# Altium project PCB_121224_01AA.PrjPcb
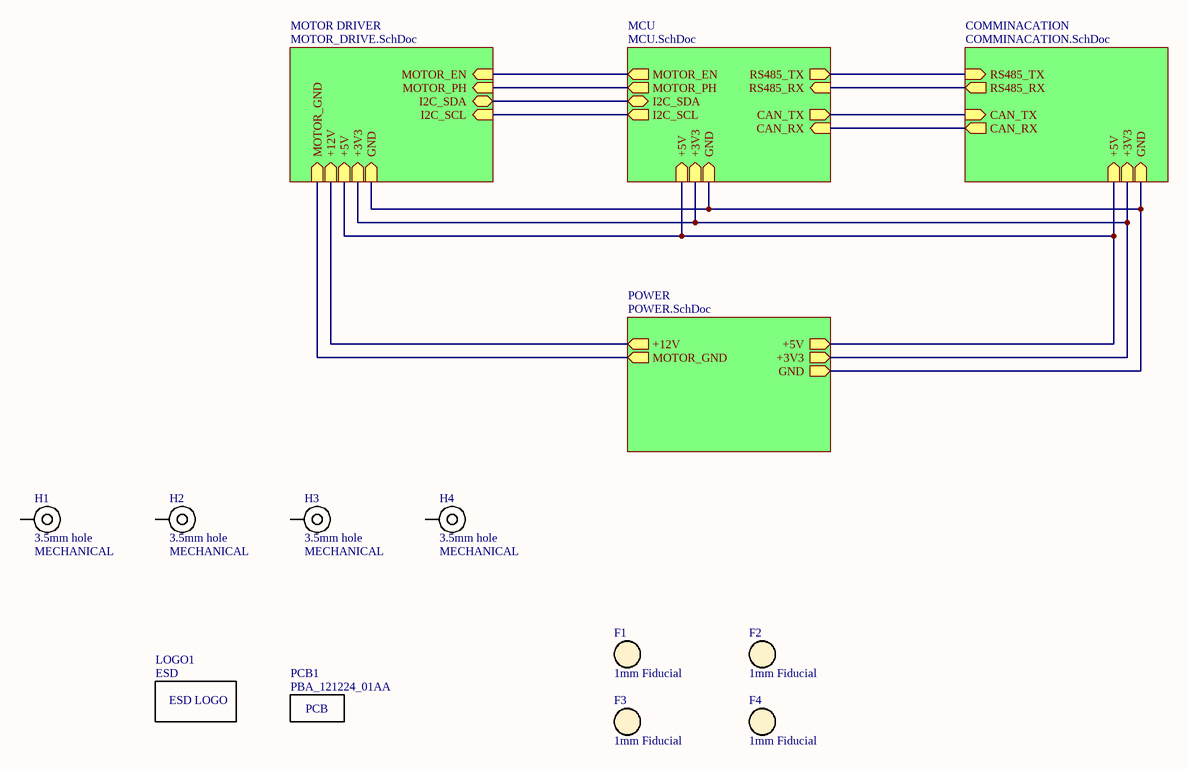
[diagram p0: MAIN.SchDoc]
DocumentName: FIZIKSEL OZELLIKLER DOKUMANI; FO_ApprovedBy: -; FO_CheckedBy: -; pApprovedBy: -; pCheckedBy: Cemil KENDİR; pDesignedBy: Cemil KENDİR; pDesignEnvironment: Altium Designer 23.9.2; pDocumentNumber: PBA_121224_01AA; pDrawnBy: Cemil KENDİR; pFoDate: 13.12.2024; pFoRevision: 01; pModifiedBy: -; pModifiedDate: -; pPBACode: 01; pPBADescription: MOTOR SURUCU KARTI; pPBARevision: AA; pPreparedBy: Cemil KENDİR; pProjectCode: 121224; pProjectName: MOTOR SURUCU KARTI; pReleaseDate: 13.12.24
5 sheets, 125 parts. Net scope: hierarchical (ports join the sheet entries above them; power ports are global).
Board file: PCB_121224_01AA.PcbDoc
Sheets:
  MAIN.SchDoc
    MCU = MCU.SchDoc
    COMMINACATION = COMMINACATION.SchDoc
    POWER = POWER.SchDoc
    MOTOR DRIVER = MOTOR_DRIVE.SchDoc

## Sheet MAIN.SchDoc
size A4; Address1: 00-<Schema Name>; DocumentNumber: 1; SheetNumber: 1; SheetTotal: 5; ModifiedBy: -; Size: A4

### Parts
F1  1mm Fiducial  [1mm Fiducial]  (no BOM)
F2  1mm Fiducial  [1mm Fiducial]  (no BOM)
F3  1mm Fiducial  [1mm Fiducial]  (no BOM)
F4  1mm Fiducial  [1mm Fiducial]  (no BOM)
H1  3.5mm hole  Category: MECHANICAL  [3.5mm hole]  (no BOM)
H2  3.5mm hole  Category: MECHANICAL  [3.5mm hole]  (no BOM)
H3  3.5mm hole  Category: MECHANICAL  [3.5mm hole]  (no BOM)
H4  3.5mm hole  Category: MECHANICAL  [3.5mm hole]  (no BOM)
LOGO1  ESD  [ESD]
PCB1  PBA_121224_01AA  (mechanical)

### Sub-sheets
COMMINACATION = COMMINACATION.SchDoc: +5V (in), GND (in), +3V3 (in), RS485_TX (in), RS485_RX (out), CAN_TX (in), CAN_RX (out)
MCU = MCU.SchDoc: +3V3 (in), GND (in), +5V (in), RS485_TX (out), RS485_RX (in), CAN_TX (out), CAN_RX (in), MOTOR_EN (out), MOTOR_PH (out), I2C_SDA (bidir), I2C_SCL (out)
MOTOR DRIVER = MOTOR_DRIVE.SchDoc: +12V (in), MOTOR_GND (in), +3V3 (in), GND (in), +5V (in), MOTOR_EN (in), MOTOR_PH (in), I2C_SDA (bidir), I2C_SCL (in)
POWER = POWER.SchDoc: +12V (out), +5V (out), +3V3 (out), GND (out), MOTOR_GND (out)

### Nets
+3V3: sheet MCU/+3V3, sheet COMMINACATION/+3V3, sheet POWER/+3V3, sheet MOTOR DRIVER/+3V3
+5V: sheet MCU/+5V, sheet COMMINACATION/+5V, sheet POWER/+5V, sheet MOTOR DRIVER/+5V
+12V: sheet POWER/+12V, sheet MOTOR DRIVER/+12V
GND: sheet MCU/GND, sheet COMMINACATION/GND, sheet POWER/GND, sheet POWER/MOTOR_GND, sheet MOTOR DRIVER/MOTOR_GND, sheet MOTOR DRIVER/GND
CAN_RX: sheet MCU/CAN_RX, sheet COMMINACATION/CAN_RX
CAN_TX: sheet MCU/CAN_TX, sheet COMMINACATION/CAN_TX
I2C_SCL: sheet MCU/I2C_SCL, sheet MOTOR DRIVER/I2C_SCL
I2C_SDA: sheet MCU/I2C_SDA, sheet MOTOR DRIVER/I2C_SDA
MOTOR_EN: sheet MCU/MOTOR_EN, sheet MOTOR DRIVER/MOTOR_EN
MOTOR_PH: sheet MCU/MOTOR_PH, sheet MOTOR DRIVER/MOTOR_PH
RS485_RX: sheet MCU/RS485_RX, sheet COMMINACATION/RS485_RX
RS485_TX: sheet MCU/RS485_TX, sheet COMMINACATION/RS485_TX

Not connected (* = marked no-connect by the designer): H1 1; H2 1; H3 1; H4 1

### Notes on the sheet
- Tarih/Date
- Tasa/Desig
- Kont/Check
- Onay/Appr
- Sayfa/Sht
- Form
- Ortam/Env
- A4
- /
- Deg Tarihi/Chng Date
- Deg Onay/Chng Appr
- Rev
- (c) 2022 by SCSG Elektronik A.Ş.
  All rights Reserved. No part of this document may be produced or transmitted in any form or by any means electronic, mechanical, photocopying, recording, or otherwise, without prior written permission of SCSG.

### Library data of the parts
F1-F4 = 1mm Fiducial: Manufacturer Part Number: Fiducial 2mm; Purpose Of Usage: BASIC; Category: MECHANICAL; Sub-Category: FIDUCIAL; Manufacturer: --; Mount: NO MOUNT; Stock ID: ??; SAP Tanım: -
H1-H4 = 3.5mm hole: 3.5mm delik; Purpose Of Usage: BASIC; Sub-Category: HOLE; Manufacturer: --; Manufacturer Part Number: --; Mount: NO MOUNT; Stock ID: ??
LOGO1 = ESD: ESD LOGO; Category: Logo
PCB1 = PCB: Manufacturer: JLC; Purpose Of Usage: BASIC; Category: MECHANICAL; Local Supplier: CUSTOM; Manufacturer Part Number: PBA_121224_01AA; Mount: MECH; Price 10K: 0.25; SAP Tanım: -; Stock ID: ??; Sub-Category: PCB; Supplier 1: CUSTOM; Supplier Part Number 1: CUSTOM

## Sheet MCU.SchDoc
size A4 portrait; Address1: 00-<Schema Name>; DocumentNumber: 2; SheetNumber: 2; SheetTotal: 5; ModifiedBy: -; Size: A4
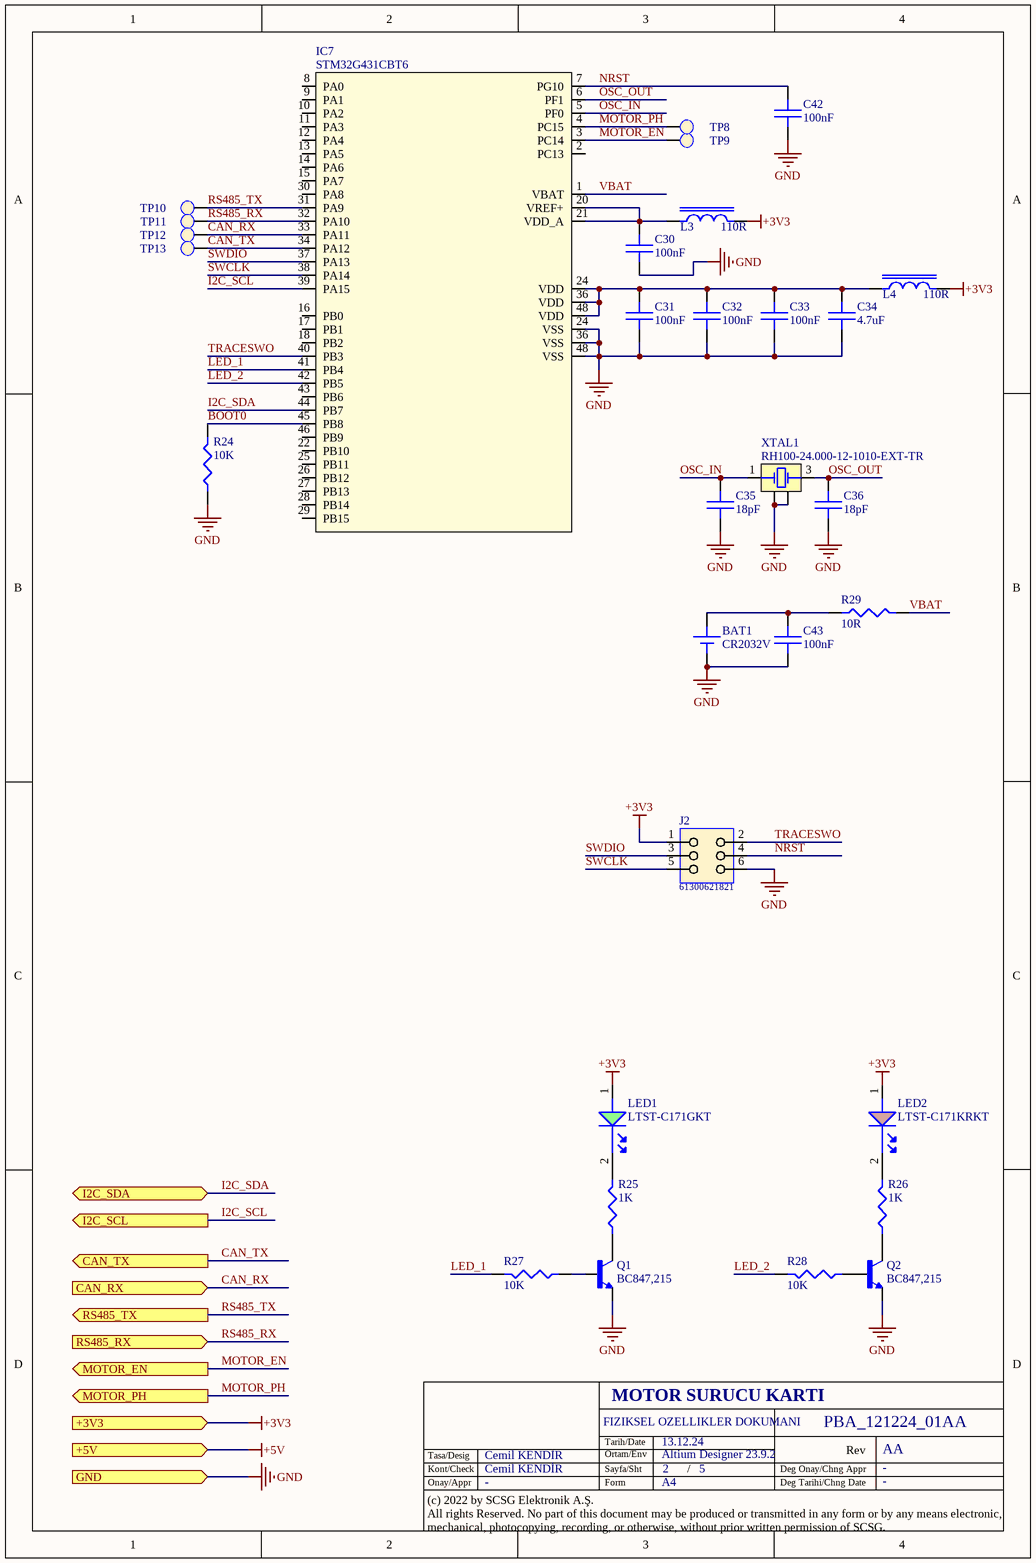
[diagram p1: MCU.SchDoc]

### Parts
BAT1  CR2032V  [CR2032V]
C30  100nF  [C0402]
C31  100nF  [C0402]
C32  100nF  [C0402]
C33  100nF  [C0402]
C34  4.7uF  [C0603]
C35  18pF  [C0402]
C36  18pF  [C0402]
C42  100nF  [C0402]
C43  100nF  [C0402]
IC7  STM32G431CBT6  [LQFP48-7x7mm]
J2  61300621821  [61300621821]
L3  110R  [L0402]
L4  110R  [L0402]
LED1  LTST-C171GKT  [0805_green]
LED2  LTST-C171KRKT  [0805_RED]
Q1  BC847,215  [SOT23-3]
Q2  BC847,215  [SOT23-3]
R24  10K  [R0402]
R25  1K  [R0402]
R26  1K  [R0402]
R27  10K  [R0402]
R28  10K  [R0402]
R29  10R  [R0402]
TP8  TestPoint1  [SMD_1mmPoint]  (value not drawn)  (no BOM)
TP9  TestPoint1  [SMD_1mmPoint]  (value not drawn)  (no BOM)
TP10  TestPoint1  [SMD_1mmPoint]  (value not drawn)  (no BOM)
TP11  TestPoint1  [SMD_1mmPoint]  (value not drawn)  (no BOM)
TP12  TestPoint1  [SMD_1mmPoint]  (value not drawn)  (no BOM)
TP13  TestPoint1  [SMD_1mmPoint]  (value not drawn)  (no BOM)
XTAL1  RH100-24.000-12-1010-EXT-TR  [WE-XTAL_CFPX-180]

### Ports
+3V3 (in), +5V (in), CAN_RX (in), CAN_TX (out), GND (in), I2C_SCL (out), I2C_SDA (bidir), MOTOR_EN (out), MOTOR_PH (out), RS485_RX (in), RS485_TX (out)

### Nets
+3V3: J2.1 L3.2 L4.2 LED1.1 LED2.1 ; port +3V3
GND: BAT1.2 C30.1 C31.1 C32.1 C33.1 C34.1 C35.1 C36.1 C42.1 C43.1 IC7.24(VSS) IC7.36(VSS) IC7.48(VSS) J2.6 Q1.2(E) Q2.2(E) R24.1 XTAL1.2(GND_&_Lid) XTAL1.4(GND_&_Lid) ; port GND
BOOT0: IC7.45(PB8) R24.2
CAN_RX: IC7.33(PA11) TP12.1 ; port CAN_RX
CAN_TX: IC7.34(PA12) TP13.1 ; port CAN_TX
I2C_SCL: IC7.39(PA15) ; port I2C_SCL
I2C_SDA: IC7.44(PB7) ; port I2C_SDA
LED_1: IC7.41(PB4) R27.2
LED_2: IC7.42(PB5) R28.2
MOTOR_EN: IC7.3(PC14) TP9.1 ; port MOTOR_EN
MOTOR_PH: IC7.4(PC15) TP8.1 ; port MOTOR_PH
NRST: C42.2 IC7.7(PG10) J2.4
OSC_IN: C35.2 IC7.5(PF0) XTAL1.1(Crystal)
OSC_OUT: C36.2 IC7.6(PF1) XTAL1.3(Crystal)
RS485_RX: IC7.32(PA10) TP11.1 ; port RS485_RX
RS485_TX: IC7.31(PA9) TP10.1 ; port RS485_TX
SWCLK: IC7.38(PA14) J2.5
SWDIO: IC7.37(PA13) J2.3
TRACESWO: IC7.40(PB3) J2.2
VBAT: IC7.1(VBAT) R29.2
NetBAT1_1: BAT1.1 C43.2 R29.1
NetC30_2: C30.2 IC7.20(VREF+) IC7.21(VDD_A) L3.1
NetC31_2: C31.2 C32.2 C33.2 C34.2 IC7.24(VDD) IC7.36(VDD) IC7.48(VDD) L4.1
NetLED1_2: LED1.2 R25.2
NetLED2_2: LED2.2 R26.2
NetQ1_1: Q1.1(B) R27.1
NetQ1_3: Q1.3(C) R25.1
NetQ2_1: Q2.1(B) R28.1
NetQ2_3: Q2.3(C) R26.1

Not connected (* = marked no-connect by the designer): IC7 2(PC13) 8(PA0) 9(PA1) 10(PA2) 11(PA3) 12(PA4) 13(PA5) 14(PA6) 15(PA7) 16(PB0) 17(PB1) 18(PB2) 22(PB10) 25(PB11) 26(PB12) 27(PB13) 28(PB14) 29(PB15) 30(PA8) 43(PB6) 46(PB9)

### Notes on the sheet
- Tarih/Date
- Tasa/Desig
- Kont/Check
- Onay/Appr
- Sayfa/Sht
- Form
- Ortam/Env
- A4
- /
- Deg Tarihi/Chng Date
- Deg Onay/Chng Appr
- Rev
- (c) 2022 by SCSG Elektronik A.Ş.
  All rights Reserved. No part of this document may be produced or transmitted in any form or by any means electronic, mechanical, photocopying, recording, or otherwise, without prior written permission of SCSG.

### Library data of the parts
BAT1 = CR2032-PEN3-A10606: CR2032 Dikey Montaj; Manufacturer: EEMB; Purpose Of Usage: RTC; Category: BATTERY; Manufacturer Part Number: CR2032-PEN3-A10606; Supplier 1: Ozdisan; Mount: THT; Sub-Category: COIN CELL; Supplier Part Number 1: CR2032-PEN3-A10606; Stock ID: ??
C30-C33 C42 = CC0402KRX7R6BB104: 100nF ,10V ,X7R ,0402; Manufacturer: Yageo; Value: 100000; Tolerance: 10%; Dielectric Material: Ceramic; Purpose Of Usage: BASIC; Supplier 1: Digi-Key; Manufacturer Part Number: CC0402KRX7R6BB104; RoHS: YES; Category: CAPASITOR; Mount: SMD; Case/Package: 0402; Case Code (Imperial): 0402; Case Code (Metric): 1005; Min Operating Temperature: -55°C; Max Operating Temperature: 125°C; Voltage Rating: 10V; Voltage Rating (DC): 10V; Dielectric: X7R; Height: 0.5mm; Supplier Part Number 1: 311-1345-1-ND; Sub-Category: CERAMIC; Stock ID: ??; Local Supplier: GENERAL; Price 10K: 0.00250
C34 = CC0603MRX7R5BB475: 4.7uF, 6.3V, X7R, 0603; Manufacturer: Yageo; Value: 4700000; Tolerance: 20%; Dielectric Material: Ceramic; Purpose Of Usage: BASIC; Supplier 1: Digi-Key; Supplier Part Number 1: 311-3496-6-ND; Manufacturer Part Number: CC0603MRX7R5BB475; RoHS: YES; Mount: SMD; Case/Package: 0603; Case Code (Imperial): 0603; Case Code (Metric): 1608; Min Operating Temperature: -55°C; Max Operating Temperature: 125°C; Voltage Rating: 6.3V; Category: CAPASITOR; Sub-Category: CERAMIC; Dielectric: X7R; Stock ID: ??; Voltage Rating (DC): 6.3V; Local Supplier: GENERAL; Price 10K: 0.00250
C35 C36 = CC0402JRNPO9BN180: 18pF, 50V, C0G, 0402; Manufacturer: Yageo; Value: 18; Tolerance: 5%; Temperature Coefficient: 30ppm/°C; Dielectric Material: Ceramic; Purpose Of Usage: BASIC; Supplier 1: Digi-Key; Manufacturer Part Number: CC0402JRNPO9BN180; RoHS: YES; Category: CAPASITOR; Mount: SMD; Case/Package: 0402; Case Code (Metric): 1005; Case Code (Imperial): 0402; Min Operating Temperature: -55°C; Max Operating Temperature: 125°C; Voltage Rating: 50V; Voltage Rating (DC): 50V; Dielectric: C0G; Height: 0.5mm; Supplier Part Number 1: 311-1415-1-ND; Sub-Category: CERAMIC; Stock ID: ??; Local Supplier: GENERAL; Price 10K: 0.00250
C43 = CC0402KRX7R6BB104: 100nF ,10V ,X7R ,0402; Manufacturer: Yageo; Value: 100000; Tolerance: 10%; Dielectric Material: Ceramic; Purpose Of Usage: RTC; Supplier 1: Digi-Key; Manufacturer Part Number: CC0402KRX7R6BB104; RoHS: YES; Category: CAPASITOR; Mount: SMD; Case/Package: 0402; Case Code (Imperial): 0402; Case Code (Metric): 1005; Min Operating Temperature: -55°C; Max Operating Temperature: 125°C; Voltage Rating: 10V; Voltage Rating (DC): 10V; Dielectric: X7R; Height: 0.5mm; Supplier Part Number 1: 311-1345-1-ND; Sub-Category: CERAMIC; Stock ID: ??; Local Supplier: GENERAL; Price 10K: 0.00250
IC7 = STM32G431CBT6: MCU 32-bit ARM Cortex M4 RISC 128KB Flash 1.8V/2.5V/3.3V 48-Pin LQFP Tray; Manufacturer: STMicroelectronics; Max Supply Voltage: 3.6V; Min Supply Voltage: 1.62V; Purpose Of Usage: BASIC; Manufacturer Part Number: STM32G431CBT6; RoHS: Yes; Category: INTEGRATED CIRCUITS; Case/Package: LQFP; Lead Free: Lead Free; Max Operating Temperature: 85°C; Min Operating Temperature: -40°C; Mount: SMD; Stock ID: ??; Sub-Category: MCU; Supplier 1: Digi-Key; Supplier Part Number 1: 497-19473-ND
J2 = 61300621821: Socket Header, THT, pitch 2.54mm, Dual Row, Vertical, 6pin; Manufacturer: Wurth Electronics; Gender: Female; Purpose Of Usage: BASIC; Manufacturer Part Number: 61300621821; Pitch: 2.54mm; Orientation: Vertical; Category: CONNECTORS; Sub-Category: SOCKET HEADER; Supplier 1: Digi-Key; Supplier Part Number 1: 732-61300621821-ND; Stock ID: ??
L3 L4 = 74269242111: Ferrite Bead, 0.09 Ohm, 1.2A, 0402;; Manufacturer: Wurth Electronics; Purpose Of Usage: BASIC; Supplier 1: Digi-Key; Manufacturer Part Number: 74269242111; RoHS: NO; Category: INDUCTORS; Stock 1: 18401; Supplier Part Number 1: 732-74269242111CT-ND; Case/Package: 0402; Mount: SMD; Stock ID: ??; Sub-Category: FERRITE BEADS
LED1 = LTST-C171GKT: LED GREEN CLEAR CHIP SMD; Manufacturer: Vishay Lite-On; Supplier 1: Digi-Key; Supplier Part Number 1: 160-1423-1-ND; Manufacturer Part Number: LTST-C171GKT; RoHS: YES; Mount: SMD; Case/Package: 0805; Color: Green; Min Operating Temperature: -55°C; Max Operating Temperature: 85°C; Category: DIODE; Sub-Category: LED; Stock ID: ??; Purpose Of Usage: LED
LED2 = LTST-C171KRKT: LED RED CLEAR SMD; Manufacturer: Vishay Lite-On; Supplier 1: Digi-Key; Supplier Part Number 1: 160-1427-1-ND; Manufacturer Part Number: LTST-C171KRKT; RoHS: YES; Mount: SMD; Case/Package: 0805; Color: Red; Min Operating Temperature: -55°C; Max Operating Temperature: 85°C; Category: DIODE; Sub-Category: LED; Stock ID: ??; Purpose Of Usage: LED
Q1 Q2 = BC847,215: TRANS NPN 45V 0.1A SOT23; Manufacturer: Nexperia; Purpose Of Usage: LED; Supplier 1: Digi-Key; Supplier Part Number 1: 1727-4855-1-ND; Manufacturer Part Number: BC847,215; RoHS: No; Category: BJT; Case/Package: SOT-23-3; Max Operating Temperature: 150°C; Min Operating Temperature: -55°C; Mount: SMD; Sub-Category: NPN; Stock ID: ??; Price 10K: 0.021; Local Supplier: OZDISAN
R24 = RC0402FR-0710KL: 10K, %1, 1/16W, 0402; Manufacturer: YAGEO; Voltage Rating: 50V; Value: 10000; Power Rating: 63mW; Tolerance: 1%; Temperature Coefficient: 100ppm/°C; Purpose Of Usage: BASIC; Supplier 1: Digi-Key; Manufacturer Part Number: RC0402FR-0710KL; RoHS: YES; Category: RESISTOR; Case/Package: 0402; Case Code (Imperial): 0402; Min Operating Temperature: -55°C; Max Operating Temperature: 155°C; Max Power Dissipation: 63mW; Voltage Rating (DC): 50V; Working Voltage: 50V; Supplier Part Number 1: 311-10.0KLRCT-ND; Stock ID: ??; Mount: SMD; Sub-Category: CHIP RESISTOR; Price 10K: 0.0025; Local Supplier: GENERAL
R25 R26 = RC0402FR-071KL: 1K, %1, 1/16W, 0402; Manufacturer: YAGEO; Tolerance: 1%; Value: 1000; Temperature Coefficient: 100ppm/°C; Power Rating: 63mW; Voltage Rating: 50V; Purpose Of Usage: LED; Supplier 1: Digi-Key; Manufacturer Part Number: RC0402FR-071KL; RoHS: YES; Category: RESISTOR; Case/Package: 0402; Case Code (Imperial): 0402; Min Operating Temperature: -55°C; Max Operating Temperature: 155°C; Voltage Rating (DC): 50V; Max Power Dissipation: 63mW; Supplier Part Number 1: 311-1.00KLRCT-ND; Stock ID: ??; Mount: SMD; Sub-Category: CHIP RESISTOR; Price 10K: 0.0025; Local Supplier: GENERAL
R27 R28 = RC0402FR-0710KL: 10K, %1, 1/16W, 0402; Manufacturer: YAGEO; Voltage Rating: 50V; Value: 10000; Power Rating: 63mW; Tolerance: 1%; Temperature Coefficient: 100ppm/°C; Purpose Of Usage: LED; Supplier 1: Digi-Key; Manufacturer Part Number: RC0402FR-0710KL; RoHS: YES; Category: RESISTOR; Case/Package: 0402; Case Code (Imperial): 0402; Min Operating Temperature: -55°C; Max Operating Temperature: 155°C; Max Power Dissipation: 63mW; Voltage Rating (DC): 50V; Working Voltage: 50V; Supplier Part Number 1: 311-10.0KLRCT-ND; Stock ID: ??; Mount: SMD; Sub-Category: CHIP RESISTOR; Price 10K: 0.0025; Local Supplier: GENERAL
R29 = RC0402FR-0710RL: 10R, %1, 1/16W, 0402; Manufacturer: YAGEO; Tolerance: 1%; Power Rating: 62.5mW; Voltage Rating: 50V; Value: 10; Temperature Coefficient: 200ppm/°C; Max Power Dissipation: 63mW; Purpose Of Usage: RTC; Supplier 1: Digi-Key; Manufacturer Part Number: RC0402FR-0710RL; RoHS: YES; Category: RESISTOR; Case/Package: 0402; Case Code (Imperial): 0402; Min Operating Temperature: -55°C; Max Operating Temperature: 155°C; Working Voltage: 50V; Supplier Part Number 1: 311-10.0LRTR-ND; Local Supplier: GENERAL; Mount: SMD; Price 10K: 0.0025; Stock ID: ??; Sub-Category: CHIP RESISTOR; Voltage Rating (DC): 50V
TP8-TP13 = TestPoint1: test ölçüm noktası; Manufacturer: NO BOM DEVICE; Purpose Of Usage: BASIC; Category: CONNECTORS; Sub-Category: TEST POINT; Manufacturer Part Number: NO BOM DEVICE; Stock ID: ??
XTAL1 = RH100-24.000-12-1010-EXT-TR: Crystal, 24Mhz, 12Pf, Smd, 3.2Mm X 2.5Mm Rohs Compliant: Yes |Raltron RH100-24.000-12-1010-EXT-TR; Manufacturer: Raltron Electronics; Value: 24000000; Purpose Of Usage: BASIC; Supplier: Digikey; Supplier Part Number 1: 2151-RH100-24.000-12-1010-EXT-TRCT-ND; Manufacturer Part Number: RH100-24.000-12-1010-EXT-TR; RoHS: No; Category: OSCILATOR; Stock: 6000; Case/Package: 3.2 x 2.4; Max Operating Temperature: +85; Min Operating Temperature: -40; Mount: SMD; Stock ID: ??; Sub-Category: CRYSTAL; Supplier 1: Digi-Key

## Sheet COMMINACATION.SchDoc
size A4 portrait; Address1: 00-<Schema Name>; DocumentNumber: 5; SheetNumber: 5; SheetTotal: 5; ModifiedBy: -; RevisionDate: -; Size: A3
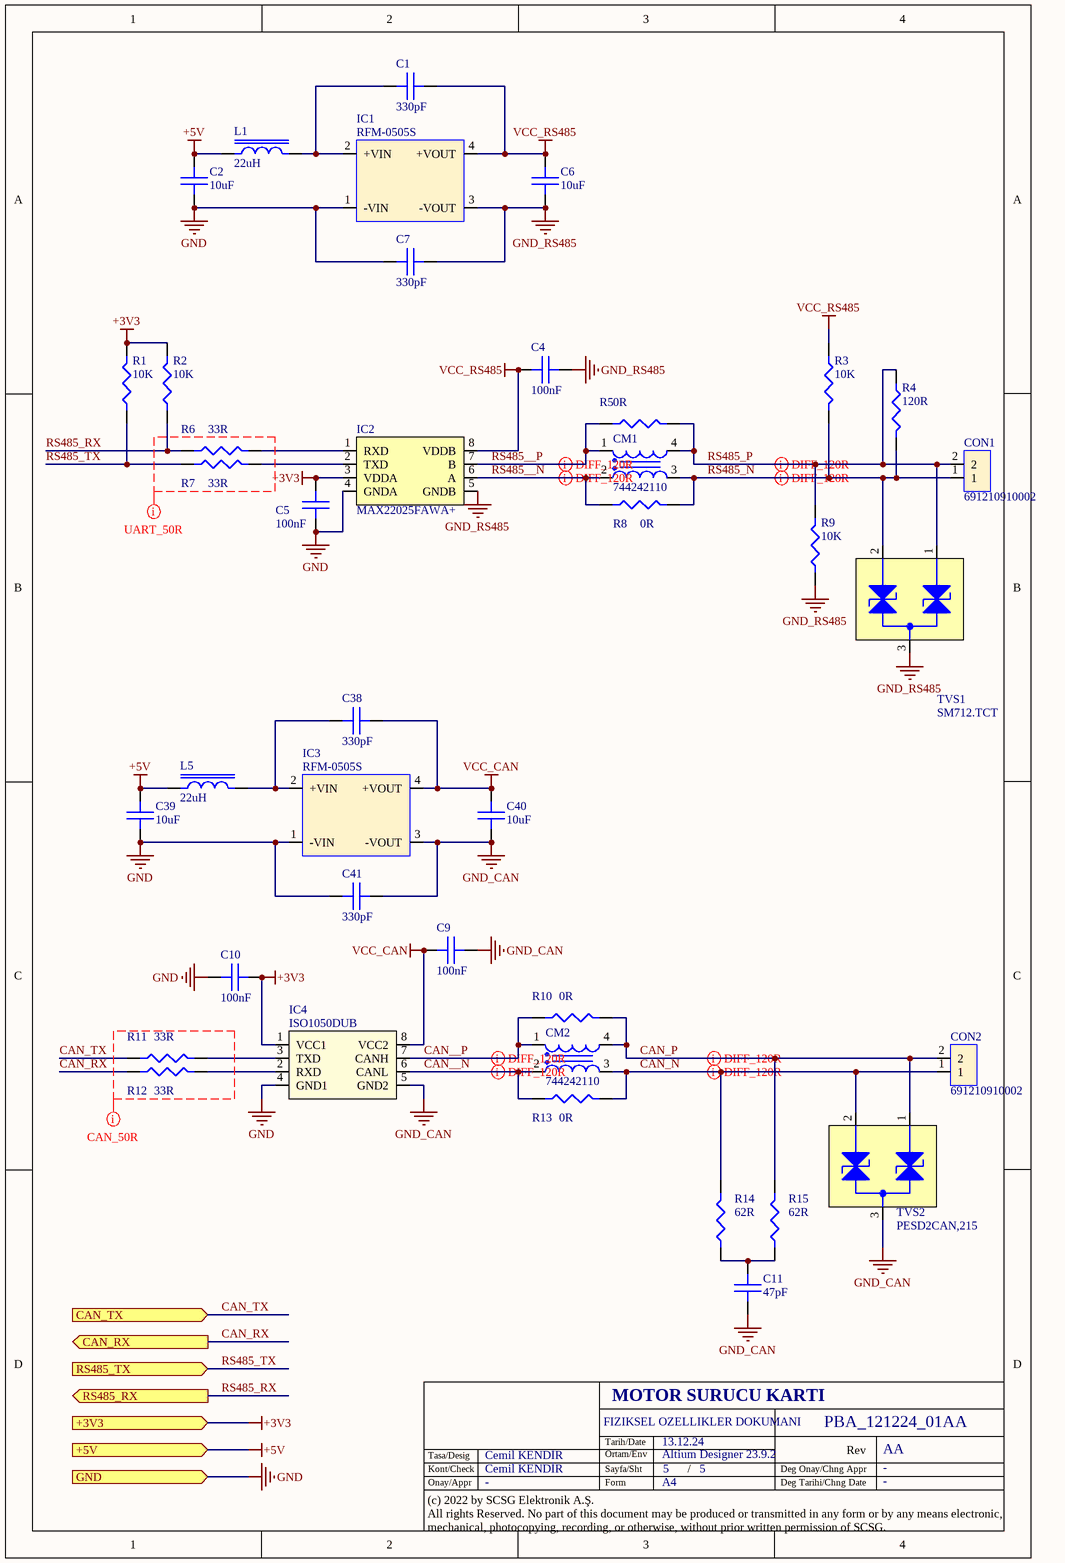
[diagram p2: COMMINACATION.SchDoc]

### Parts
C1  330pF  [C1206]
C2  10uF  [C0402]
C4  100nF  [C0402]
C5  100nF  [C0402]
C6  10uF  [C0402]
C7  330pF  [C1206]
C9  100nF  [C0402]
C10  100nF  [C0402]
C11  47pF  [C0402]
C38  330pF  [C1206]
C39  10uF  [C0402]
C40  10uF  [C0402]
C41  330pF  [C1206]
CM1  744242110  [WE-SLM_L6W3.3H3.3]
CM2  744242110  [WE-SLM_L6W3.3H3.3]
CON1  691210910002  [691210910002]
CON2  691210910002  [691210910002]
IC1  RFM-0505S  [RFM-0505S]
IC2  MAX22025FAWA+  [WIDE SOIC 08]
IC3  RFM-0505S  [RFM-0505S]
IC4  ISO1050DUB  [SOP254P1040X485-8N]
L1  22uH  [WE-LQ_1210]
L5  22uH  [WE-LQ_1210]
R1  10K  [R0402]
R2  10K  [R0402]
R3  10K  [R0402]
R4  120R  [R0603]
R5  0R  [R0402]
R6  33R  [R0402]
R7  33R  [R0402]
R8  0R  [R0402]
R9  10K  [R0402]
R10  0R  [R0402]
R11  33R  [R0402]
R12  33R  [R0402]
R13  0R  [R0402]
R14  62R  [R0805]
R15  62R  [R0805]
TVS1  SM712.TCT  [WE-TVS_SOT23-3L]
TVS2  PESD2CAN,215  [WE-TVS_SOT23-3L]

### Ports
+3V3 (in), +5V (in), CAN_RX (out), CAN_TX (in), GND (in), RS485_RX (out), RS485_TX (in)

### Nets
+3V3: C5.2 C10.2 IC2.3(VDDA) IC4.1(VCC1) R1.2 R2.2 ; port +3V3
+5V: C2.2 C39.2 L1.1 L5.1 ; port +5V
GND: C2.1 C5.1 C7.1 C10.1 C39.1 C41.1 IC1.1(-VIN) IC2.4(GNDA) IC3.1(-VIN) IC4.4(GND1) ; port GND
GND_CAN: C9.1 C11.1 C40.1 C41.2 IC3.3(-VOUT) IC4.5(GND2) TVS2.3(GND)
GND_RS485: C4.1 C6.1 C7.2 IC1.3(-VOUT) IC2.5(GNDB) R9.1 TVS1.3(GND)
VCC_CAN: C9.2 C38.2 C40.2 IC3.4(+VOUT) IC4.8(VCC2)
VCC_RS485: C1.2 C4.2 C6.2 IC1.4(+VOUT) IC2.8(VDDB) R3.1
CAN__N: CM2.2 IC4.6(CANL) R13.1
CAN__P: CM2.1 IC4.7(CANH) R10.1
CAN_N: CM2.3 CON2.1 R13.2 R14.2 TVS2.2(I/O_2)
CAN_P: CM2.4 CON2.2 R10.2 R15.2 TVS2.1(I/O_1)
CAN_RX: R12.1 ; port CAN_RX
CAN_TX: R11.1 ; port CAN_TX
RS485__N: CM1.2 IC2.6(A) R8.1
RS485__P: CM1.1 IC2.7(B) R5.1
RS485_N: CM1.3 CON1.1 R3.2 R4.2 R8.2 TVS1.2(I/O_2)
RS485_P: CM1.4 CON1.2 R4.1 R5.2 R9.2 TVS1.1(I/O_1)
RS485_RX: R2.1 R6.1 ; port RS485_RX
RS485_TX: R1.1 R7.1 ; port RS485_TX
NetC1_1: C1.1 IC1.2(+VIN) L1.2
NetC11_2: C11.2 R14.1 R15.1
NetC38_1: C38.1 IC3.2(+VIN) L5.2
NetIC2_1: IC2.1(RXD) R6.2
NetIC2_2: IC2.2(TXD) R7.2
NetIC4_2: IC4.2(RXD) R12.2
NetIC4_3: IC4.3(TXD) R11.2

### Layout directives
differential pair; differential pair class RS485_120R: RS485__N, RS485__P, RS485_N, RS485_P
differential pair; differential pair class CAN_120R: CAN__N, CAN__P, CAN_N, CAN_P
net class UART_50R: (no net found under the mark)
net class CAN_50R: (no net found under the mark)

### Notes on the sheet
- Tarih/Date
- Tasa/Desig
- Kont/Check
- Onay/Appr
- Sayfa/Sht
- Form
- Ortam/Env
- A4
- /
- Deg Tarihi/Chng Date
- Deg Onay/Chng Appr
- Rev
- (c) 2022 by SCSG Elektronik A.Ş.
  All rights Reserved. No part of this document may be produced or transmitted in any form or by any means electronic, mechanical, photocopying, recording, or otherwise, without prior written permission of SCSG.

### Library data of the parts
C1 C7 = CC1206JKNPOCBN331: 330pF, 1000V,  C0G, 1206; Manufacturer: Yageo; Temperature Coefficient: 30ppm/°C; Dielectric Material: Ceramic; Purpose Of Usage: RS485; Tolerance: 5%; Value: 330000; Manufacturer Part Number: CC1206JKNPOCBN331; RoHS: YES; Category: CAPASITOR; Case/Package: 1206; Case Code (Imperial): 0805; Case Code (Metric): 3216; Dielectric: C0G; Height: 1.15mm; Local Supplier: GENERAL; Max Operating Temperature: 125°C; Min Operating Temperature: -55°C; Mount: SMD; Price 10K: 0.00250; Stock ID: ??; Sub-Category: CERAMIC; Supplier 1: Digi-Key; Supplier Part Number 1: 311-3626-1-ND; Voltage Rating (DC): 1000V; Voltage Rating: 1000V
C2 C6 = GRM155R60J106ME15D: 10uF, 6.3V, X5R, 0402; Manufacturer: Murata; Value: 10000000; Tolerance: 20%; Dielectric Material: Ceramic; Purpose Of Usage: RS485; Supplier 1: Digi-Key; Manufacturer Part Number: GRM155R60J106ME15D; RoHS: YES; Category: CAPASITOR; Mount: SMD; Case/Package: 0402; Case Code (Metric): 1005; Case Code (Imperial): 0402; Min Operating Temperature: -55°C; Max Operating Temperature: 85°C; Voltage Rating: 6.3V; Voltage Rating (DC): 6.3V; Dielectric: X5R; Supplier Part Number 1: 490-13238-1-ND; Sub-Category: CERAMIC; Stock ID: ??; Local Supplier: GENERAL; Price 10K: 0.00250
C4 C5 = CC0402KRX7R6BB104: 100nF ,10V ,X7R ,0402; Manufacturer: Yageo; Value: 100000; Tolerance: 10%; Dielectric Material: Ceramic; Purpose Of Usage: RS485; Supplier 1: Digi-Key; Manufacturer Part Number: CC0402KRX7R6BB104; RoHS: YES; Category: CAPASITOR; Mount: SMD; Case/Package: 0402; Case Code (Imperial): 0402; Case Code (Metric): 1005; Min Operating Temperature: -55°C; Max Operating Temperature: 125°C; Voltage Rating: 10V; Voltage Rating (DC): 10V; Dielectric: X7R; Height: 0.5mm; Supplier Part Number 1: 311-1345-1-ND; Sub-Category: CERAMIC; Stock ID: ??; Local Supplier: GENERAL; Price 10K: 0.00250
C9 C10 = CC0402KRX7R6BB104: 100nF ,10V ,X7R ,0402; Manufacturer: Yageo; Value: 100000; Tolerance: 10%; Dielectric Material: Ceramic; Purpose Of Usage: CAN; Supplier 1: Digi-Key; Manufacturer Part Number: CC0402KRX7R6BB104; RoHS: YES; Category: CAPASITOR; Mount: SMD; Case/Package: 0402; Case Code (Imperial): 0402; Case Code (Metric): 1005; Min Operating Temperature: -55°C; Max Operating Temperature: 125°C; Voltage Rating: 10V; Voltage Rating (DC): 10V; Dielectric: X7R; Height: 0.5mm; Supplier Part Number 1: 311-1345-1-ND; Sub-Category: CERAMIC; Stock ID: ??; Local Supplier: GENERAL; Price 10K: 0.00250
C11 = CC0402JRNPO9BN470: 47pF, 50V, NP0, 0402; Manufacturer: Yageo; Dielectric Material: Ceramic; Value: 47; Tolerance: 5%; Dielectric: C0G; Purpose Of Usage: CAN; Supplier 1: Digi-Key; Manufacturer Part Number: CC0402JRNPO9BN470; RoHS: YES; Category: CAPASITOR; Case/Package: 0402; Case Code (Metric): 1005; Case Code (Imperial): 0402; Min Operating Temperature: -55°C; Max Operating Temperature: 125°C; Voltage Rating: 50V; Voltage Rating (DC): 50V; Height: 0.5mm; Supplier Part Number 1: 311-1021-2-ND; Mount: SMD; Sub-Category: CERAMIC; Local Supplier: GENERAL; Price 10K: 0.00250; Stock ID: ??
C38 C41 = CC1206JKNPOCBN331: 330pF, 1000V,  C0G, 1206; Manufacturer: Yageo; Temperature Coefficient: 30ppm/°C; Dielectric Material: Ceramic; Purpose Of Usage: CAN; Tolerance: 5%; Value: 330000; Manufacturer Part Number: CC1206JKNPOCBN331; RoHS: YES; Category: CAPASITOR; Case/Package: 1206; Case Code (Imperial): 0805; Case Code (Metric): 3216; Dielectric: C0G; Height: 1.15mm; Local Supplier: GENERAL; Max Operating Temperature: 125°C; Min Operating Temperature: -55°C; Mount: SMD; Price 10K: 0.00250; Stock ID: ??; Sub-Category: CERAMIC; Supplier 1: Digi-Key; Supplier Part Number 1: 311-3626-1-ND; Voltage Rating (DC): 1000V; Voltage Rating: 1000V
C39 C40 = GRM155R60J106ME15D: 10uF, 6.3V, X5R, 0402; Manufacturer: Murata; Value: 10000000; Tolerance: 20%; Dielectric Material: Ceramic; Purpose Of Usage: CAN; Supplier 1: Digi-Key; Manufacturer Part Number: GRM155R60J106ME15D; RoHS: YES; Category: CAPASITOR; Mount: SMD; Case/Package: 0402; Case Code (Metric): 1005; Case Code (Imperial): 0402; Min Operating Temperature: -55°C; Max Operating Temperature: 85°C; Voltage Rating: 6.3V; Voltage Rating (DC): 6.3V; Dielectric: X5R; Supplier Part Number 1: 490-13238-1-ND; Sub-Category: CERAMIC; Stock ID: ??; Local Supplier: GENERAL; Price 10K: 0.00250
CM1 = 744242110: Data Line Filter, 2 Function(s), 80V, 0.3A, 4 Pin(s); Manufacturer: Wurth Electronics; Purpose Of Usage: RS485; Manufacturer Part Number: 744242110; RoHS: Yes; Category: PROTECTION; Local Supplier: Wurth Electronics; Mount: SMD; Stock ID: ??; Sub-Category: FILTER-COMMON MODE; Supplier 1: Digikey; Supplier Part Number 1: 732-1681-1-ND
CM2 = 744242110: Data Line Filter, 2 Function(s), 80V, 0.3A, 4 Pin(s); Manufacturer: Wurth Electronics; Purpose Of Usage: CAN; Manufacturer Part Number: 744242110; RoHS: Yes; Category: PROTECTION; Local Supplier: Wurth Electronics; Mount: SMD; Stock ID: ??; Sub-Category: FILTER-COMMON MODE; Supplier 1: Digikey; Supplier Part Number 1: 732-1681-1-ND
CON1 = 691210910002: 2.54 Mm Terminal Block, Horizont; Manufacturer: Wurth Electronics; Purpose Of Usage: RS485; Supplier 1: Digi-Key; Supplier Part Number 1: 732-691210910002-ND; Manufacturer Part Number: 691210910002; RoHS: No; Category: CONNECTORS; Sub-Category: TERMINAL BLOCK; Stock ID: ??
CON2 = 691210910002: 2.54 Mm Terminal Block, Horizont; Manufacturer: Wurth Electronics; Purpose Of Usage: CAN; Supplier 1: Digi-Key; Supplier Part Number 1: 732-691210910002-ND; Manufacturer Part Number: 691210910002; RoHS: No; Category: CONNECTORS; Sub-Category: TERMINAL BLOCK; Stock ID: ??
IC1 = RFM-0505S: RECOM POWER - RFM-0505S - Isolated Board Mount DC/DC Converter, ITE & General, 1 Output, 1 W, 5 V, 200 mA; Purpose Of Usage: RS485; Supplier 1: Digi-Key; Manufacturer: Recom; Manufacturer Part Number: RFM-0505S; RoHS: No; Supplier Part Number 1: 945-3159-ND; Category: MODULE; Mount: SMD; Stock ID: ??; Sub-Category: DC-DC CONVERTERS
IC2 = MAX22025FAWA+: IC Transceiver Half 1/1 8SOIC; Manufacturer: Analog Devices; Purpose Of Usage: RS485; Manufacturer Part Number: MAX22025FAWA+; RoHS: No; Category: INTEGRATED CIRCUITS; Case/Package: WIDE SOIC; Lead Free: Lead Free; Max Operating Temperature: 85°C; Min Operating Temperature: -40°C; Mount: SMD; Stock ID: ??; Sub-Category: RS485 DRIVER; Supplier 1: Digi-Key; Supplier Part Number 1: 505-MAX22025FAWA+-ND
IC3 = RFM-0505S: RECOM POWER - RFM-0505S - Isolated Board Mount DC/DC Converter, ITE & General, 1 Output, 1 W, 5 V, 200 mA; Purpose Of Usage: CAN; Supplier 1: Digi-Key; Manufacturer: Recom; Manufacturer Part Number: RFM-0505S; RoHS: No; Supplier Part Number 1: 945-3159-ND; Category: MODULE; Mount: SMD; Stock ID: ??; Sub-Category: DC-DC CONVERTERS
IC4 = ISO1050DUB: EAR99 ISO1050 Tube CANbus interface transceiver 5V 73mA 850.995985mg 74ns; Manufacturer: Texas Instruments; Max Supply Voltage: 5.5V; Min Supply Voltage: 3V; Purpose Of Usage: CAN; Manufacturer Part Number: ISO1050DUB; RoHS: Yes; Category: INTEGRATED CIRCUITS; Case/Package: SOP; Min Operating Temperature: -55°C; Max Operating Temperature: 105°C; Package Quantity: 50; Lead Free: Lead Free; Mount: SMD; Stock ID: ??; Sub-Category: CAN DRIVER; Supplier 1: Digi-Key; Supplier Part Number 1: 296-33295-5-ND
L1 = 744032220: General Purpose Inductor, 22uH, 10%, 1 Element, Ferrite-Core, SMD, 1210; Manufacturer: Wurth Electronics; Purpose Of Usage: RS485; Manufacturer Part Number: 744032220; RoHS: YES; Category: INDUCTORS; Case/Package: 1210; Local Supplier: Würth; Max Operating Temperature: 125°C; Min Operating Temperature: -40°C; Mount: SMD; Price 10K: 0.18; Stock ID: ??; Sub-Category: FIXED INDUCTORS; Supplier 1: Digi-Key; Supplier Part Number 1: 732-3058-1-ND; Value: 22uH
L5 = 744032220: General Purpose Inductor, 22uH, 10%, 1 Element, Ferrite-Core, SMD, 1210; Manufacturer: Wurth Electronics; Purpose Of Usage: CAN; Manufacturer Part Number: 744032220; RoHS: YES; Category: INDUCTORS; Case/Package: 1210; Local Supplier: Würth; Max Operating Temperature: 125°C; Min Operating Temperature: -40°C; Mount: SMD; Price 10K: 0.18; Stock ID: ??; Sub-Category: FIXED INDUCTORS; Supplier 1: Digi-Key; Supplier Part Number 1: 732-3058-1-ND; Value: 22uH
R1-R3 R9 = RC0402FR-0710KL: 10K, %1, 1/16W, 0402; Manufacturer: YAGEO; Voltage Rating: 50V; Value: 10000; Power Rating: 63mW; Tolerance: 1%; Temperature Coefficient: 100ppm/°C; Purpose Of Usage: RS485; Supplier 1: Digi-Key; Manufacturer Part Number: RC0402FR-0710KL; RoHS: YES; Category: RESISTOR; Case/Package: 0402; Case Code (Imperial): 0402; Min Operating Temperature: -55°C; Max Operating Temperature: 155°C; Max Power Dissipation: 63mW; Voltage Rating (DC): 50V; Working Voltage: 50V; Supplier Part Number 1: 311-10.0KLRCT-ND; Stock ID: ??; Mount: SMD; Sub-Category: CHIP RESISTOR; Price 10K: 0.0025; Local Supplier: GENERAL
R4 = RC0603FR-07120RL: 120R ,%1 ,1/10 W ,0603; Manufacturer: YAGEO; Value: 120; Tolerance: 1%; Voltage Rating (DC): 50V; Temperature Coefficient: 100ppm/°C; Power Rating: 100mW; Purpose Of Usage: RS485; Supplier 1: Digi-Key; Supplier Part Number 1: 311-120HRCT-ND; Manufacturer Part Number: RC0603FR-07120RL; RoHS: YES; Case/Package: 0603; Case Code (Imperial): 0603; Min Operating Temperature: -55°C; Max Operating Temperature: 155°C; Voltage Rating: 50V; Max Power Dissipation: 100mW; Category: RESISTOR; Sub-Category: CHIP RESISTOR; Stock ID: ??; Mount: SMD; Price 10K: 0.0025; Local Supplier: GENERAL
R5 R8 = RC0402FR-070RL: 0R, %1, 1/10W,  0402; Manufacturer: YAGEO; Value: 0; Tolerance: 1%; Power Rating: 63mW; Voltage Rating: 50V; Temperature Coefficient: 200ppm/°C; Purpose Of Usage: RS485; Supplier 1: Digi-Key; Manufacturer Part Number: RC0402FR-070RL; RoHS: YES; Mount: SMD; Case/Package: 0402; Case Code (Imperial): 0402; Min Operating Temperature: -55°C; Max Operating Temperature: 155°C; Max Power Dissipation: 63mW; Category: RESISTOR; Supplier Part Number 1: 311-0.0LRCT-ND; Sub-Category: CHIP RESISTOR; Stock ID: ??; Price 10K: 0.0025; Local Supplier: GENERAL
R6 R7 = RC0402JR-0733RL: 33R, %5, 1/16W ,0402; Manufacturer: YAGEO; Value: 33; Tolerance: 5%; Power Rating: 63mW; Voltage Rating: 50V; Temperature Coefficient: 100ppm/°C; Purpose Of Usage: RS485; Supplier 1: Digi-Key; Manufacturer Part Number: RC0402JR-0733RL; RoHS: YES; Category: RESISTOR; Case/Package: 0402; Case Code (Imperial): 0402; Min Operating Temperature: -55°C; Max Operating Temperature: 155°C; Max Power Dissipation: 63mW; Supplier Part Number 1: 311-33JRCT-ND; Stock ID: ??; Mount: SMD; Sub-Category: CHIP RESISTOR; Price 10K: 0.0025; Local Supplier: GENERAL
R10 R13 = RC0402FR-070RL: 0R, %1, 1/10W,  0402; Manufacturer: YAGEO; Value: 0; Tolerance: 1%; Power Rating: 63mW; Voltage Rating: 50V; Temperature Coefficient: 200ppm/°C; Purpose Of Usage: CAN; Supplier 1: Digi-Key; Manufacturer Part Number: RC0402FR-070RL; RoHS: YES; Mount: SMD; Case/Package: 0402; Case Code (Imperial): 0402; Min Operating Temperature: -55°C; Max Operating Temperature: 155°C; Max Power Dissipation: 63mW; Category: RESISTOR; Supplier Part Number 1: 311-0.0LRCT-ND; Sub-Category: CHIP RESISTOR; Stock ID: ??; Price 10K: 0.0025; Local Supplier: GENERAL
R11 R12 = RC0402JR-0733RL: 33R, %5, 1/16W ,0402; Manufacturer: YAGEO; Value: 33; Tolerance: 5%; Power Rating: 63mW; Voltage Rating: 50V; Temperature Coefficient: 100ppm/°C; Purpose Of Usage: CAN; Supplier 1: Digi-Key; Manufacturer Part Number: RC0402JR-0733RL; RoHS: YES; Category: RESISTOR; Case/Package: 0402; Case Code (Imperial): 0402; Min Operating Temperature: -55°C; Max Operating Temperature: 155°C; Max Power Dissipation: 63mW; Supplier Part Number 1: 311-33JRCT-ND; Stock ID: ??; Mount: SMD; Sub-Category: CHIP RESISTOR; Price 10K: 0.0025; Local Supplier: GENERAL
R14 R15 = RC0805JR-0762RL: 62R, %5, 1/8W, 0805; Manufacturer: YAGEO; Max Power Dissipation: 125mW; Purpose Of Usage: CAN; Temperature Coefficient: 100ppm/°C; Tolerance: 5%; Value: 62; Voltage Rating: 150V; Manufacturer Part Number: RC0805JR-0762RL; RoHS: YES; Category: RESISTOR; Case/Package: 0805; Case Code (Imperial): 0805; Local Supplier: GENERAL; Max Operating Temperature: 155°C; Min Operating Temperature: -55°C; Mount: SMD; Power Rating: 125mW; Price 10K: 0.0025; Stock ID: ??; Sub-Category: CHIP RESISTOR; Supplier 1: Digi-Key; Supplier Part Number 1: 311-62ARCT-ND
TVS1 = SM712.TCT: SM Series 12 V 400 W Asymmetrical TVS Diode for Extended Common-Mode - SOT-23; Manufacturer: Semtech; Direction: Bidirectional; Number of Elements: 2; Min Breakdown Voltage: 7.5V; Clamping Voltage: 26V; Peak Pulse Power: 400W; Leakage Current: 1uA; Peak Pulse Current: 17A; Working Voltage: 12V; Max Breakdown Voltage: 13.3V; ESD Protection: Yes; Max Reverse Leakage Current: 20uA; Number of Channels: 2NUMBER; Purpose Of Usage: RS485; Manufacturer Part Number: SM712.TCT; RoHS: Yes; Category: PROTECTION; Mounting Technology: Surface Mount; Case/Package: SOT-23; Pins: 3; Min Operating Temperature: -55°C; Max Operating Temperature: 125°C; Number of Bidirectional Channels: 2; Power Dissipation: 400W; Polarity: Bidirectional; Max Power Dissipation: 400W; Breakdown Voltage: 13.3V; Voltage Rating (DC): 12V; Clamping Voltage-Max: 12V; Length: 2.9mm; Lead Free: Lead Free; Local Supplier: GENERAL; Mount: SMD; Power Rating: 400W; Price 10K: 0.5; Stock ID: ??; Sub-Category: TVS - BI DIRECTIONAL; Supplier 1: Digikey; Supplier Part Number 1: SM712CT-ND
TVS2 = PESD2CAN,215: PESD Series 2 Channel Bi-Directional CAN Bus ESD Protection Diode - SOT-23; Manufacturer: Nexperia USA; Manufacturer Part Number: PESD2CAN,215; RoHS: No; Category: PROTECTION; Case/Package: SOT-23; Local Supplier: GENERAL; Mount: SMD; Stock ID: ??; Sub-Category: TVS - BI DIRECTIONAL; Supplier Part Number 1: 1727-3891-2-ND; Purpose Of Usage: CAN; Supplier 1: Digikey

## Sheet POWER.SchDoc
size A4; Address1: 00-<Schema Name>; DocumentNumber: 3; SheetNumber: 3; SheetTotal: 5; ModifiedBy: -; Size: A4
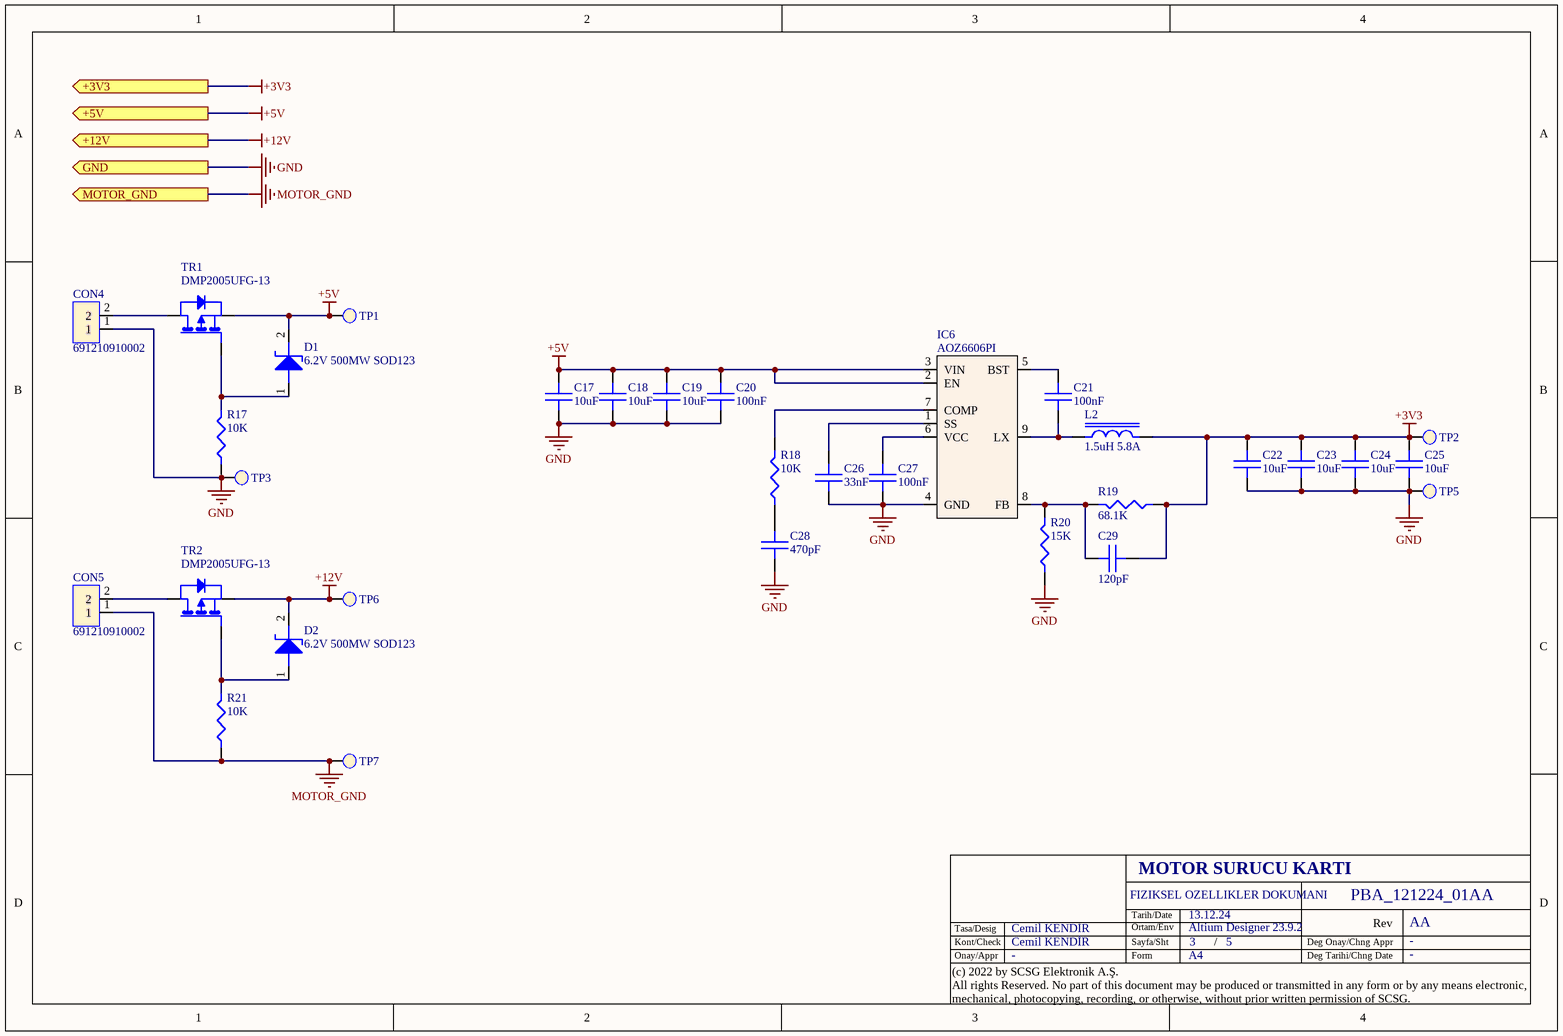
[diagram p3: POWER.SchDoc]

### Parts
C17  10uF  [C0805]
C18  10uF  [C0805]
C19  10uF  [C0805]
C20  100nF  [C0402]
C21  100nF  [C0402]
C22  10uF  [C0805]
C23  10uF  [C0805]
C24  10uF  [C0805]
C25  10uF  [C0805]
C26  33nF  [C0402]
C27  100nF  [C0402]
C28  470pF  [C0402]
C29  120pF  [C0402]
CON4  691210910002  [691210910002]
CON5  691210910002  [691210910002]
D1  6.2V 500MW SOD123  [SOD123]
D2  6.2V 500MW SOD123  [SOD123]
IC6  AOZ6606PI  [SO08 - EP1]
L2  1.5uH 5.8A  [WE-MAPI_4020]
R17  10K  [R0402]
R18  10K  [R0402]
R19  68.1K  [R0402]
R20  15K  [R0402]
R21  10K  [R0402]
TP1  TestPoint1  [SMD_1mmPoint]  (value not drawn)  (no BOM)
TP2  TestPoint1  [SMD_1mmPoint]  (value not drawn)  (no BOM)
TP3  TestPoint1  [SMD_1mmPoint]  (value not drawn)  (no BOM)
TP5  TestPoint1  [SMD_1mmPoint]  (value not drawn)  (no BOM)
TP6  TestPoint1  [SMD_1mmPoint]  (value not drawn)  (no BOM)
TP7  TestPoint1  [SMD_1mmPoint]  (value not drawn)  (no BOM)
TR1  DMP2005UFG-13  [PowerDI3333-8]
TR2  DMP2005UFG-13  [PowerDI3333-8]

### Ports
+3V3 (out), +5V (out), +12V (out), GND (out), MOTOR_GND (out)

### Nets
+3V3: C22.2 C23.2 C24.2 C25.2 C29.2 L2.2 R19.1 TP2.1 ; port +3V3
+5V: C17.2 C18.2 C19.2 C20.2 D1.2(K) IC6.2(EN) IC6.3(VIN) TP1.1 TR1.1(S) ; port +5V
+12V: D2.2(K) TP6.1 TR2.1(S) ; port +12V
GND: C17.1 C18.1 C19.1 C20.1 C22.1 C23.1 C24.1 C25.1 C26.1 C27.1 C28.1 CON4.1 CON5.1 IC6.4(GND) R17.1 R20.1 R21.1 TP3.1 TP5.1 TP7.1 ; port GND, port MOTOR_GND  [also labelled MOTOR_GND]
NetC21_1: C21.1 IC6.5(BST)
NetC21_2: C21.2 IC6.9(LX) L2.1
NetC26_2: C26.2 IC6.1(SS)
NetC27_2: C27.2 IC6.6(VCC)
NetC28_2: C28.2 R18.1
NetC29_1: C29.1 IC6.8(FB) R19.2 R20.2
NetCON4_2: CON4.2 TR1.3(D)
NetCON5_2: CON5.2 TR2.3(D)
NetD1_1: D1.1(A) R17.2 TR1.2(G)
NetD2_1: D2.1(A) R21.2 TR2.2(G)
NetIC6_7: IC6.7(COMP) R18.2

### Notes on the sheet
- Tarih/Date
- Tasa/Desig
- Kont/Check
- Onay/Appr
- Sayfa/Sht
- Form
- Ortam/Env
- A4
- /
- Deg Tarihi/Chng Date
- Deg Onay/Chng Appr
- Rev
- (c) 2022 by SCSG Elektronik A.Ş.
  All rights Reserved. No part of this document may be produced or transmitted in any form or by any means electronic, mechanical, photocopying, recording, or otherwise, without prior written permission of SCSG.

### Library data of the parts
C17-C19 C22-C25 = CC0805KFX7R6BB106: 10uF ,10V ,X7R ,0805; Manufacturer: Yageo; Value: 10000000; Dielectric Material: Ceramic; Tolerance: 10%; Purpose Of Usage: BASIC; Supplier 1: Digi-Key; Manufacturer Part Number: CC0805KFX7R6BB106; RoHS: YES; Supplier Part Number 1: 13-CC0805KFX7R6BB106CT-ND; Category: CAPASITOR; Sub-Category: CERAMIC; Case/Package: 0805; Case Code (Imperial): 0805; Case Code (Metric): 2012; Dielectric: X7R; Max Operating Temperature: 125°C; Min Operating Temperature: -55°C; Mount: SMD; Stock ID: ??; Voltage Rating (DC): 10V; Voltage Rating: 10V; Local Supplier: GENERAL; Price 10K: 0.00250
C20 C21 C27 = CC0402KRX7R6BB104: as C30 on sheet MCU; Supplier 1: Digi-Key; Manufacturer Part Number: CC0402KRX7R6BB104; RoHS: YES; Category: CAPASITOR; Mount: SMD; Case/Package: 0402; Case Code (Imperial): 0402; Case Code (Metric): 1005; Min Operating Temperature: -55°C; Max Operating Temperature: 125°C; Voltage Rating: 10V; Voltage Rating (DC): 10V; Dielectric: X7R; Height: 0.5mm; Supplier Part Number 1: 311-1345-1-ND; Sub-Category: CERAMIC; Stock ID: ??; Local Supplier: GENERAL; Price 10K: 0.00250
C26 = CC0402KRX7R9BB333: 33nF, 50V, X7R, 0402; Manufacturer: Yageo; Value: 33000; Temperature Coefficient: 30ppm/°C; Dielectric Material: Ceramic; Purpose Of Usage: BASIC; Tolerance: 10%; Manufacturer Part Number: CC0402KRX7R9BB333; RoHS: YES; Category: CAPASITOR; Case/Package: 0402; Min Operating Temperature: -55°C; Max Operating Temperature: 125°C; Dielectric: X7R; Voltage Rating: 50V; Voltage Rating (DC): 50V; Height: 0.5mm; Case Code (Imperial): 0402; Case Code (Metric): 1005; Local Supplier: GENERAL; Mount: SMD; Price 10K: 0.00250; Stock ID: ??; Sub-Category: CERAMIC; Supplier 1: Digi-Key; Supplier Part Number 1: 13-CC0402KRX7R9BB333CT-ND
C28 = CC0402JRNPO9BN471: 470pF, 50V, NP0, 0402; Manufacturer: Yageo; Tolerance: 5%; Value: 470; Dielectric: C0G; Dielectric Material: Ceramic; Purpose Of Usage: BASIC; Supplier 1: Digi-Key; Manufacturer Part Number: CC0402JRNPO9BN471; RoHS: YES; Category: CAPASITOR; Case/Package: 0402; Case Code (Imperial): 0402; Case Code (Metric): 1005; Min Operating Temperature: -55°C; Max Operating Temperature: 125°C; Voltage Rating (DC): 50V; Voltage Rating: 50V; Supplier Part Number 1: 311-1671-2-ND; Height: 0.5mm; Local Supplier: GENERAL; Mount: SMD; Price 10K: 0.00250; Stock ID: ??; Sub-Category: CERAMIC
C29 = CC0402JRNPO9BN121: 120pF, 50V, NP0, 0402; Manufacturer: Yageo; Tolerance: 5%; Value: 120; Dielectric: C0G; Dielectric Material: Ceramic; Purpose Of Usage: BASIC; Supplier 1: Digi-Key; Manufacturer Part Number: CC0402JRNPO9BN121; RoHS: YES; Category: CAPASITOR; Mount: SMD; Case/Package: 0402; Case Code (Imperial): 0402; Case Code (Metric): 1005; Min Operating Temperature: -55°C; Max Operating Temperature: 125°C; Voltage Rating: 50V; Voltage Rating (DC): 50V; Height: 0.5mm; Supplier Part Number 1: 311-3337-1-ND; Sub-Category: CERAMIC; Stock ID: ??; Local Supplier: GENERAL; Price 10K: 0.00250
CON4 CON5 = 691210910002: 2.54 Mm Terminal Block, Horizont; Manufacturer: Wurth Electronics; Purpose Of Usage: BASIC; Supplier 1: Digi-Key; Supplier Part Number 1: 732-691210910002-ND; Manufacturer Part Number: 691210910002; RoHS: No; Category: CONNECTORS; Sub-Category: TERMINAL BLOCK; Stock ID: ??
D1 D2 = MMSZ5234B-7-F: DIODE ZENER 6.2V 500MW SOD123; Manufacturer: Diodes; Element Configuration: Single; Purpose Of Usage: BASIC; Supplier 1: Digi-Key; Supplier Part Number 1: MMSZ5234B-FDICT-ND; Manufacturer Part Number: MMSZ5234B-7-F; RoHS: YES; Mount: SMD; Case/Package: SOD-123-2; Min Operating Temperature: -65°C; Max Operating Temperature: 150°C; Category: DIODE; Sub-Category: ZENER; Stock ID: ??
IC6 = AOZ6606PI: Switching Regulator, Current-mode, 6A, 650kHz Switching Freq-Max, PDSO8; Manufacturer: Alpha & Omega Semiconductor; Max Supply Voltage: 15.3V; Min Supply Voltage: 4.5V; Purpose Of Usage: BASIC; Topology: BUCK; Manufacturer Part Number: AOZ6606PI; RoHS: Yes; Category: INTEGRATED CIRCUITS; Case/Package: SO-08 EP; Lead Free: Lead Free; Max Operating Temperature: 85°C; Min Operating Temperature: -40°C; Mount: SMD; Stock ID: ??; Sub-Category: PMIC - DC/DC Switching Regulator; Supplier 1: Digi-Key; Supplier Part Number 1: 785-1854-1-ND
L2 = 74438356015: Fixed Ind 1.5UH 5.8A 19 Mohm SMD; Manufacturer: Wurth Electronics; Saturation Current: 7.8A; Shielding: Shielded; DC Resistance (DCR): 19mR; Self Resonant Frequency: 48MHz; Test Frequency: 100kHz; Tolerance: 20%; Purpose Of Usage: BASIC; Manufacturer Part Number: 74438356015; RoHS: YES; Category: INDUCTORS; Case/Package: Nonstandard; Min Operating Temperature: -40°C; Max Operating Temperature: 125°C; Value: 1.5uH; Current Rating: 5.8A; RMS Current (Irms): 5.8A; Inductance Tolerance: 20%; Series: WE-MAPI; Length: 0.161inch; RoHS Compliant: Yes; Mount: SMD; Stock ID: ??; Sub-Category: FIXED INDUCTORS; Supplier 1: Digi-Key; Supplier Part Number 1: 732-8230-1-ND
R17 R18 R21 = RC0402FR-0710KL: as R24 on sheet MCU; Supplier 1: Digi-Key; Manufacturer Part Number: RC0402FR-0710KL; RoHS: YES; Category: RESISTOR; Case/Package: 0402; Case Code (Imperial): 0402; Min Operating Temperature: -55°C; Max Operating Temperature: 155°C; Max Power Dissipation: 63mW; Voltage Rating (DC): 50V; Working Voltage: 50V; Supplier Part Number 1: 311-10.0KLRCT-ND; Stock ID: ??; Mount: SMD; Sub-Category: CHIP RESISTOR; Price 10K: 0.0025; Local Supplier: GENERAL
R19 = RC0402FR-0768K1L: 68.1K, %1, 1/16W, 0402; Manufacturer: YAGEO; Voltage Rating (DC): 50V; Max Power Dissipation: 63mW; Power Rating: 62.5mW; Purpose Of Usage: BASIC; Temperature Coefficient: 100ppm/°C; Tolerance: 1%; Value: 68100; Manufacturer Part Number: RC0402FR-0768K1L; RoHS: YES; Category: RESISTOR; Case/Package: 0402; Case Code (Imperial): 0402; Local Supplier: GENERAL; Max Operating Temperature: 155°C; Min Operating Temperature: -55°C; Mount: SMD; Price 10K: 0.0025; Stock ID: ??; Sub-Category: CHIP RESISTOR; Supplier 1: Digi-Key; Supplier Part Number 1: YAG3213CT-ND; Voltage Rating: 50V
R20 = RC0402FR-0715KL: 15K, %1, 1/16W, 0402; Manufacturer: YAGEO; Tolerance: 1%; Power Rating: 62.5mW; Value: 15000; Voltage Rating: 50V; Temperature Coefficient: 100ppm/°C; Max Power Dissipation: 63mW; Purpose Of Usage: BASIC; Manufacturer Part Number: RC0402FR-0715KL; RoHS: Yes; Category: RESISTOR; Case/Package: 0402; Case Code (Imperial): 0402; Min Operating Temperature: -55°C; Max Operating Temperature: 155°C; Voltage Rating (DC): 50V; Local Supplier: GENERAL; Mount: SMD; Price 10K: 0.0025; Stock ID: ??; Sub-Category: CHIP RESISTOR; Supplier 1: Digi-Key; Supplier Part Number 1: 311-15.0KLRCT-ND
TP1-TP3 TP5-TP7 = TestPoint1: as TP8 on sheet MCU; Category: CONNECTORS; Sub-Category: TEST POINT; Manufacturer Part Number: NO BOM DEVICE; Stock ID: ??
TR1 TR2 = DMP2005UFG-13: 20V P-channel Enhancement Mode Mosfet, 20V Vds, 10±V Vgs; Manufacturer: Diodes; Max Power Dissipation: 2.2W; Purpose Of Usage: BASIC; Manufacturer Part Number: DMP2005UFG-13; RoHS: Yes; Category: MOSFETs; Min Operating Temperature: -55°C; Max Operating Temperature: 150°C; Case/Package: DI3333-8; Mount: SMD; Polarity: P-CHANNEL; Stock ID: ??; Sub-Category: P-CHANNEL; Supplier 1: Digi-Key; Supplier Part Number 1: 31-DMP2005UFG-13CT-ND

## Sheet MOTOR_DRIVE.SchDoc
size A4; DocumentNumber: 4; SheetNumber: 4; SheetTotal: 5
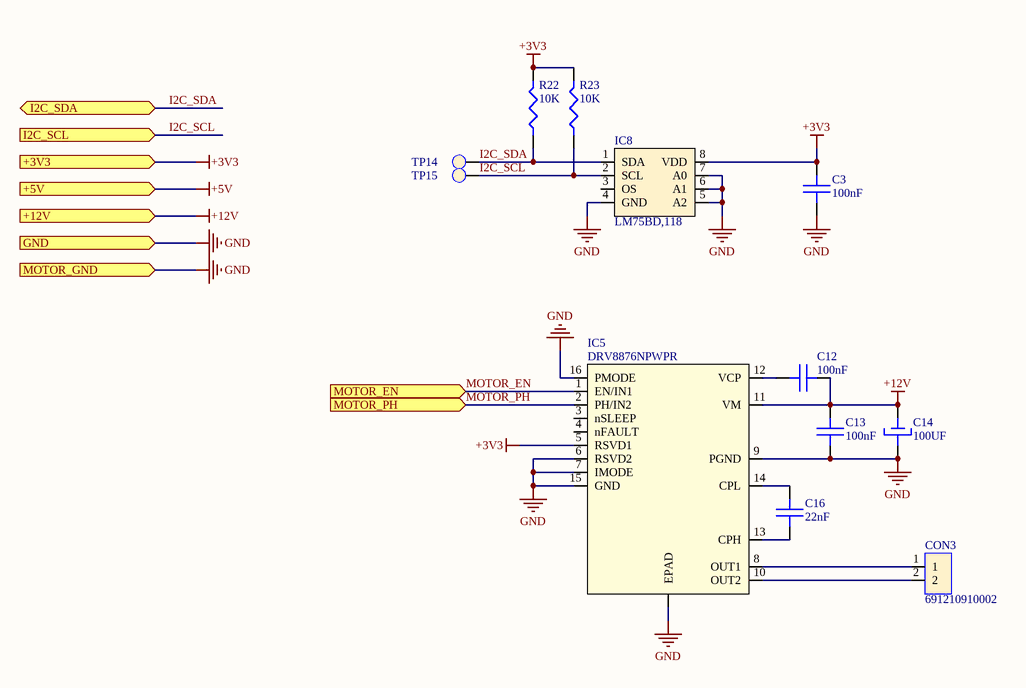
[diagram p4: MOTOR_DRIVE.SchDoc]

### Parts
C3  100nF  [C0402]
C12  100nF  [C0603]
C13  100nF  [C0603]
C14  100UF  [6mm Aliminyum Smd]
C16  22nF  [C0805]
CON3  691210910002  [691210910002]
IC5  DRV8876NPWPR  [HTSSOP16_4P4X5_TEX-M]
IC8  LM75BD,118  [SO08]
R22  10K  [R0402]
R23  10K  [R0402]
TP14  TestPoint1  [SMD_1mmPoint]  (value not drawn)  (no BOM)
TP15  TestPoint1  [SMD_1mmPoint]  (value not drawn)  (no BOM)

### Ports
+3V3 (in), +5V (in), +12V (in), GND (in), I2C_SCL (in), I2C_SDA (bidir), MOTOR_EN (in), MOTOR_GND (in), MOTOR_PH (in)

### Nets
+3V3: C3.2 IC5.5(RSVD1) IC8.8(VDD) R22.2 R23.2 ; port +3V3
+12V: C12.2 C13.2 C14.1 IC5.11(VM) ; port +12V
GND: C3.1 C13.1 C14.2 IC5.6(RSVD2) IC5.7(IMODE) IC5.9(PGND) IC5.15(GND) IC5.16(PMODE) IC5.EPAD IC8.4(GND) IC8.5(A2) IC8.6(A1) IC8.7(A0) ; port GND, port MOTOR_GND
I2C_SCL: IC8.2(SCL) R23.1 TP15.1 ; port I2C_SCL
I2C_SDA: IC8.1(SDA) R22.1 TP14.1 ; port I2C_SDA
MOTOR_EN: IC5.1(EN/IN1) ; port MOTOR_EN
MOTOR_PH: IC5.2(PH/IN2) ; port MOTOR_PH
NetC12_1: C12.1 IC5.12(VCP)
NetC16_1: C16.1 IC5.13(CPH)
NetC16_2: C16.2 IC5.14(CPL)
NetCON3_1: CON3.1 IC5.8(OUT1)
NetCON3_2: CON3.2 IC5.10(OUT2)

Not connected (* = marked no-connect by the designer): IC5 3(nSLEEP) 4(nFAULT); IC8 3(OS)

### Notes on the sheet
- Tarih/Date
- Tasa/Desig
- Kont/Check
- Onay/Appr
- Sayfa/Sht
- Form
- Ortam/Env
- A4
- /
- Deg Tarihi/Chng Date
- Deg Onay/Chng Appr
- Rev
- (c) 2022 by SCSG Elektronik A.Ş.
  All rights Reserved. No part of this document may be produced or transmitted in any form or by any means electronic, mechanical, photocopying, recording, or otherwise, without prior written permission of SCSG.

### Library data of the parts
C3 = CC0402KRX7R6BB104: 100nF ,10V ,X7R ,0402; Manufacturer: Yageo; Value: 100000; Tolerance: 10%; Dielectric Material: Ceramic; Purpose Of Usage: MOTOR; Supplier 1: Digi-Key; Manufacturer Part Number: CC0402KRX7R6BB104; RoHS: YES; Category: CAPASITOR; Mount: SMD; Case/Package: 0402; Case Code (Imperial): 0402; Case Code (Metric): 1005; Min Operating Temperature: -55°C; Max Operating Temperature: 125°C; Voltage Rating: 10V; Voltage Rating (DC): 10V; Dielectric: X7R; Height: 0.5mm; Supplier Part Number 1: 311-1345-1-ND; Sub-Category: CERAMIC; Stock ID: ??; Local Supplier: GENERAL; Price 10K: 0.00250
C12 C13 = CC0603KRX7R8BB104: 100nF, 25V, X7R, 0603; Manufacturer: Yageo; Value: 100000; Tolerance: 10%; Dielectric Material: Ceramic; Purpose Of Usage: MOTOR; Supplier 1: Digi-Key; Supplier Part Number 1: 311-1341-1-ND; Manufacturer Part Number: CC0603KRX7R8BB104; RoHS: YES; Mount: SMD; Case/Package: 0603; Case Code (Imperial): 0603; Case Code (Metric): 1608; Min Operating Temperature: -55°C; Max Operating Temperature: 125°C; Voltage Rating: 25V; Voltage Rating (DC): 25V; Dielectric: X7R; Height: 0.8mm; Category: CAPASITOR; Sub-Category: CERAMIC; Stock ID: ??; Local Supplier: GENERAL; Price 10K: 0.00250
C14 = UWX1C101MCL1GB: 100uF, 16V, ELC, 6.3mm SMD; Manufacturer: Nichicon; Dielectric Material: Aluminium; Value: 100000000; Tolerance: 20%; Dielectric: Polymer; Purpose Of Usage: MOTOR; Supplier 1: Digi-Key; Supplier Part Number 1: 493-2105-1-ND; Manufacturer Part Number: UWX1C101MCL1GB; RoHS: YES; Mount: SMD; Case/Package: Radial; Min Operating Temperature: -40°C; Max Operating Temperature: 85°C; Voltage Rating: 16V; Voltage Rating (DC): 16V; Diameter: 6.3mm; Height: 5.5mm; Category: CAPASITOR; Sub-Category: ALUMINUM; Stock ID: ??; Case Code (Imperial): 6.3 mm; Local Supplier: GENERAL; Price 10K: 0.00250
C16 = CC0805KRX7R9BB223: 22nF, 50 V, X7R, 0805; Manufacturer: Yageo; Dielectric Material: Ceramic; Value: 22000; Tolerance: 10%; Voltage Rating: 50V; Purpose Of Usage: MOTOR; Supplier 1: Digi-Key; Manufacturer Part Number: CC0805KRX7R9BB223; RoHS: YES; Category: CAPASITOR; Case/Package: 0805; Case Code (Metric): 2012; Case Code (Imperial): 0805; Min Operating Temperature: -55°C; Max Operating Temperature: 125°C; Voltage Rating (DC): 50V; Dielectric: X7R; Height: 0.6mm; Supplier Part Number 1: 311-1138-2-ND; Local Supplier: GENERAL; Mount: SMD; Price 10K: 0.00250; Sub-Category: CERAMIC; Stock ID: ??
CON3 = 691210910002: 2.54 Mm Terminal Block, Horizont; Manufacturer: Wurth Electronics; Purpose Of Usage: MOTOR; Supplier 1: Digi-Key; Supplier Part Number 1: 732-691210910002-ND; Manufacturer Part Number: 691210910002; RoHS: No; Category: CONNECTORS; Sub-Category: TERMINAL BLOCK; Stock ID: ??
IC5 = DRV8876NPWPR: 37-V, 3.5-A brushed DC motor driver 16-HTSSOP -40 to 125; Manufacturer: Texas Instruments; Max Supply Voltage: 35V; Min Supply Voltage: 4.5V; Manufacturer Part Number: DRV8876NPWPR; RoHS: Yes; Category: INTEGRATED CIRCUITS; Case/Package: HTSSOP - 16; Lead Free: Lead Free; Max Operating Temperature: 85°C; Min Operating Temperature: -40°C; Mount: SMD; Purpose Of Usage: MOTOR; Stock ID: ??; Sub-Category: MOTOR DRIVER; Supplier 1: Digikey; Supplier Part Number 1: 296-DRV8876NPWPRCT-ND
IC8 = LM75BD,118: LM75 Series 5.5 V I2C Digital Temperature Sensor and Thermal Watchdog - SOIC-8; Manufacturer: NXP Semiconductors; Purpose Of Usage: MOTOR; Manufacturer Part Number: LM75BD,118; RoHS: Yes; Category: SENSOR; Case/Package: SOIC; Min Operating Temperature: -55°C; Max Operating Temperature: 125°C; Stock ID: ??; Mount: SMD; Sub-Category: TEMPERATURE; Supplier 1: Digi-Key; Supplier Part Number 1: 568-4688-1-ND
R22 R23 = RC0402FR-0710KL: 10K, %1, 1/16W, 0402; Manufacturer: YAGEO; Voltage Rating: 50V; Value: 10000; Power Rating: 63mW; Tolerance: 1%; Temperature Coefficient: 100ppm/°C; Purpose Of Usage: MOTOR; Supplier 1: Digi-Key; Manufacturer Part Number: RC0402FR-0710KL; RoHS: YES; Category: RESISTOR; Case/Package: 0402; Case Code (Imperial): 0402; Min Operating Temperature: -55°C; Max Operating Temperature: 155°C; Max Power Dissipation: 63mW; Voltage Rating (DC): 50V; Working Voltage: 50V; Supplier Part Number 1: 311-10.0KLRCT-ND; Stock ID: ??; Mount: SMD; Sub-Category: CHIP RESISTOR; Price 10K: 0.0025; Local Supplier: GENERAL
TP14 TP15 = TestPoint1: test ölçüm noktası; Manufacturer: NO BOM DEVICE; Purpose Of Usage: MOTOR; Category: CONNECTORS; Sub-Category: TEST POINT; Manufacturer Part Number: NO BOM DEVICE; Stock ID: ??

## Nets that join several sheets
+3V3: MCU (5 pins), COMMINACATION (6 pins), POWER (8 pins), MOTOR_DRIVE (5 pins)
+5V: COMMINACATION (C2.2 C39.2 L1.1 L5.1), POWER (9 pins)
+12V: POWER (D2.2 TP6.1 TR2.1), MOTOR_DRIVE (C12.2 C13.2 C14.1 IC5.11)
GND: MCU (19 pins), COMMINACATION (10 pins), POWER (20 pins), MOTOR_DRIVE (13 pins)
CAN_RX: MCU (IC7.33 TP12.1), COMMINACATION (R12.1)
CAN_TX: MCU (IC7.34 TP13.1), COMMINACATION (R11.1)
I2C_SCL: MCU (IC7.39), MOTOR_DRIVE (IC8.2 R23.1 TP15.1)
I2C_SDA: MCU (IC7.44), MOTOR_DRIVE (IC8.1 R22.1 TP14.1)
MOTOR_EN: MCU (IC7.3 TP9.1), MOTOR_DRIVE (IC5.1)
MOTOR_PH: MCU (IC7.4 TP8.1), MOTOR_DRIVE (IC5.2)
RS485_RX: MCU (IC7.32 TP11.1), COMMINACATION (R2.1 R6.1)
RS485_TX: MCU (IC7.31 TP10.1), COMMINACATION (R1.1 R7.1)

## Assembly variants
AA: not fitted F1 F2 F3 F4 H1 H2 J1 LOGO1 LOGO2